# Altium schematic sheet Sheet1.SchDoc
size A
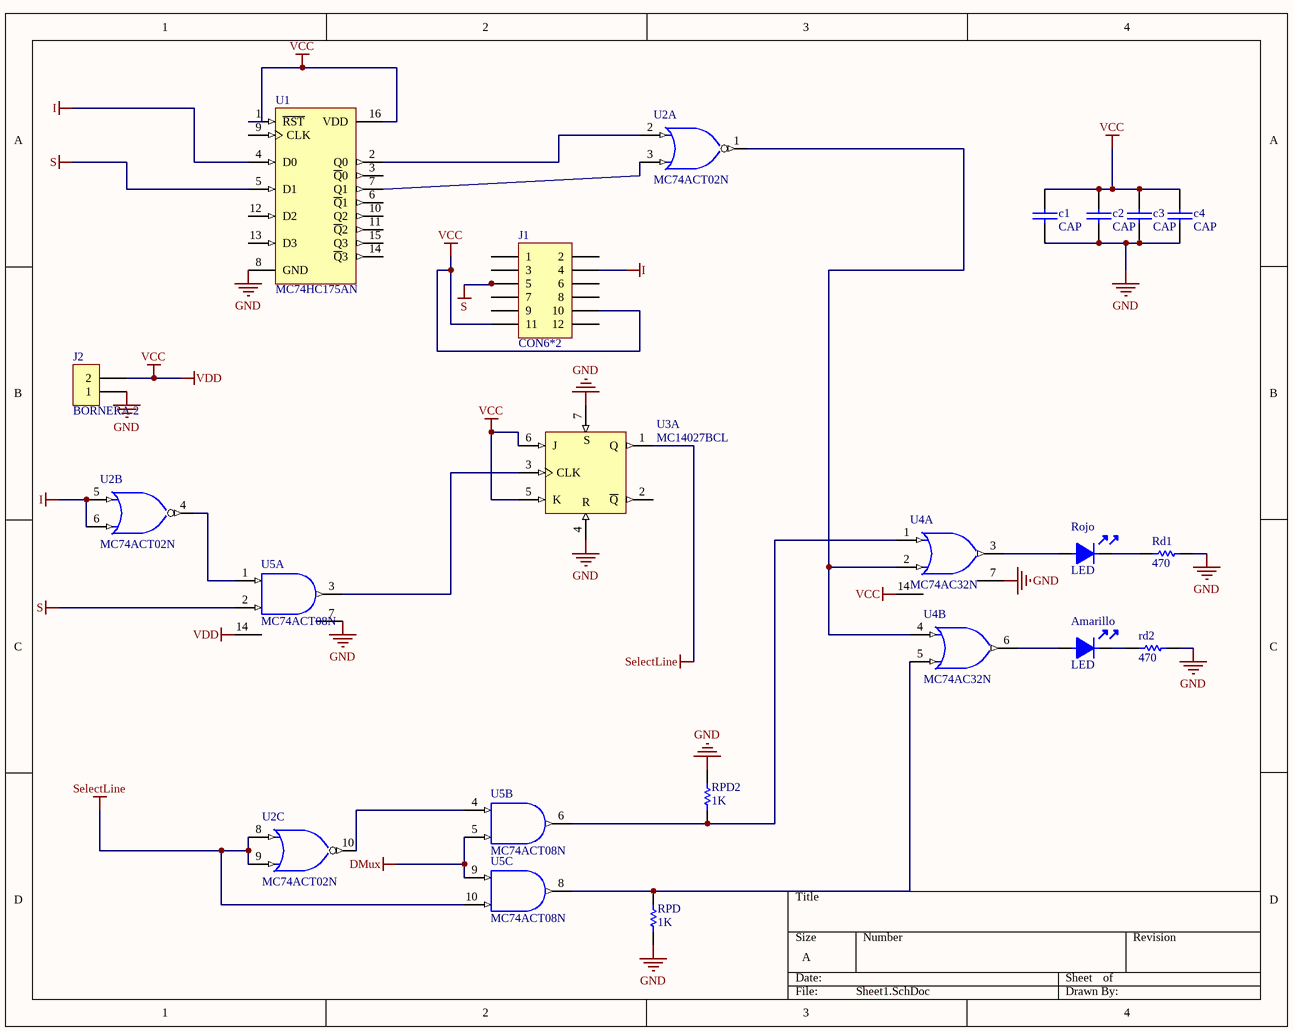
[diagram p0: Sheet1.SchDoc]

## Parts
Amarillo  LED  [LED3]
c1  CAP  [0805]
c2  CAP  [0805]
c3  CAP  [0805]
c4  CAP  [0805]
J1  CON6*2  [SIP6*2]
J2  BORNERA 2  [BORNERA2]
Rd1  470  [0805]
rd2  470  [0805]
Rojo  LED  [LED3]
RPD  1K  [0805]
RPD2  1K  [0805]
U1  MC74HC175AN  [648-08]
U2  MC74ACT02N  [646-06]  (parts A,B,C of 4)
U3  MC14027BCL  [620-10]  (part A of 2)
U4  MC74AC32N  [646-06]  (parts A,B of 4)
U5  MC74ACT08N  [646-06]  (parts A,B,C of 4)

## Nets
DMux: U5.5(B) U5.9(A)
GND: c1.2 c2.2 c3.2 c4.2 J2.1 Rd1.2 rd2.2 RPD.1 RPD2.2 U1.8(GND) U2.7(GND) U3.4(R) U3.7(S) U3.8(GND) U4.7(GND) U5.7(GND)
I: J1.4 U1.4(D0) U2.5(A) U2.6(B)
S: J1.5 U1.5(D1) U5.2(B)
SelectLine: U2.8(A) U2.9(B) U3.1(Q) U5.10(B)
VCC: c1.1 c2.1 c3.1 c4.1 J1.10 J1.11 J2.2 U1.1(~{RST}) U1.16(VDD) U2.14(VCC) U3.5(K) U3.6(J) U3.16(VDD) U4.14(VDD) U5.14(VDD)  [also labelled VDD]
NetAmarillo_1: Amarillo.1 U4.6(Y)
NetAmarillo_2: Amarillo.2 rd2.1
NetRd1_1: Rd1.1 Rojo.2
NetRojo_1: Rojo.1 U4.3(Y)
NetRPD2_1: RPD2.1 U4.1(A) U5.6(Y)
NetRPD_2: RPD.2 U4.5(B) U5.8(Y)
NetU1_2: U1.2(Q0) U2.2(A)
NetU1_7: U1.7(Q1) U2.3(B)
NetU2_1: U2.1(~{Y}) U4.2(B) U4.4(A)
NetU2_4: U2.4(~{Y}) U5.1(A)
NetU2_10: U2.10(~{Y}) U5.4(A)
NetU3_3: U3.3(CLK) U5.3(Y)

Not connected (* = marked no-connect by the designer): J1 1 2 3 6 7 8 9 12; U1 3(~{Q}0) 6(~{Q}1) 9(CLK) 10(Q2) 11(~{Q}2) 12(D2) 13(D3) 14(~{Q}3) 15(Q3); U3 2(~{Q})

## Library data of the parts
Rd1 rd2 RPD RPD2 = RES
U1 = MC74HC175AN: Quad D-Type Flip-Flop with Common Clock and Reset; Published: 15-Apr-2002; DatasheetVersion: Mar-2000; PackageVersion: Apr-2000; PackageReference: 648-08; Publisher: Altium Limited; PackageDescription: DIP; 16 Leads; Row Spacing 7.62 mm; Pitch 2.54 mm; Code_JEDEC: MS-001-BB; ComponentLink1Description: Manufacturer Link; ComponentLink1URL: http://www.onsemi.com/; ComponentLink2Description: Datasheet; ComponentLink2URL: http://www.onsemi.com/pub/Collateral/MC74HC175A-D.PDF
U2 = MC74ACT02N: Quad 2-Input NOR Gate; Published: 15-Apr-2002; DatasheetVersion: 9-Apr-1996; PackageVersion: 1995; PackageReference: 646-06; Publisher: Altium Limited; PackageDescription: DIP; 14 Leads; Row Spacing 7.62 mm; Pitch 2.54 mm; ComponentLink1Description: Manufacturer Link; ComponentLink1URL: http://www.onsemi.com/; ComponentLink2Description: Datasheet; ComponentLink2URL: http://www.onsemi.com/pub/Collateral/MC74AC02-D.PDF
U3 = MC14027BCL: Dual J-K Flip-Flop; Published: 15-Apr-2002; DatasheetVersion: 1995; PackageVersion: 1996; PackageReference: 620-10; Publisher: Altium Limited; PackageDescription: DIP; 16 Leads; Row Spacing 7.62 mm; Pitch 2.54 mm; ComponentLink1Description: Manufacturer Link; ComponentLink1URL: http://www.onsemi.com/; ComponentLink2Description: Datasheet; ComponentLink2URL: http://www.onsemi.com/pub/Collateral/MC14027B-D.PDF
U4 = MC74AC32N: Quad 2-Input OR Gate; Published: 15-Apr-2002; DatasheetVersion: 9-Apr-1996; PackageVersion: 1995; PackageReference: 646-06; Publisher: Altium Limited; PackageDescription: DIP; 14 Leads; Row Spacing 7.62 mm; Pitch 2.54 mm; ComponentLink1Description: Manufacturer Link; ComponentLink1URL: http://www.onsemi.com/; ComponentLink2Description: Datasheet; ComponentLink2URL: http://www.onsemi.com/pub/Collateral/MC74AC32-D.PDF
U5 = MC74ACT08N: Quad 2-Input AND Gate; Published: 15-Apr-2002; DatasheetVersion: 9-Apr-1996; PackageVersion: 1995; PackageReference: 646-06; Publisher: Altium Limited; PackageDescription: DIP; 14 Leads; Row Spacing 7.62 mm; Pitch 2.54 mm; ComponentLink1Description: Manufacturer Link; ComponentLink1URL: http://www.onsemi.com/; ComponentLink2Description: Datasheet; ComponentLink2URL: http://www.onsemi.com/pub/Collateral/MC74AC08-D.PDF